# Altium schematic sheet STM32.SchDoc: STM32H563ZIT6
size B; SheetNumber: 3; SheetTotal: 14
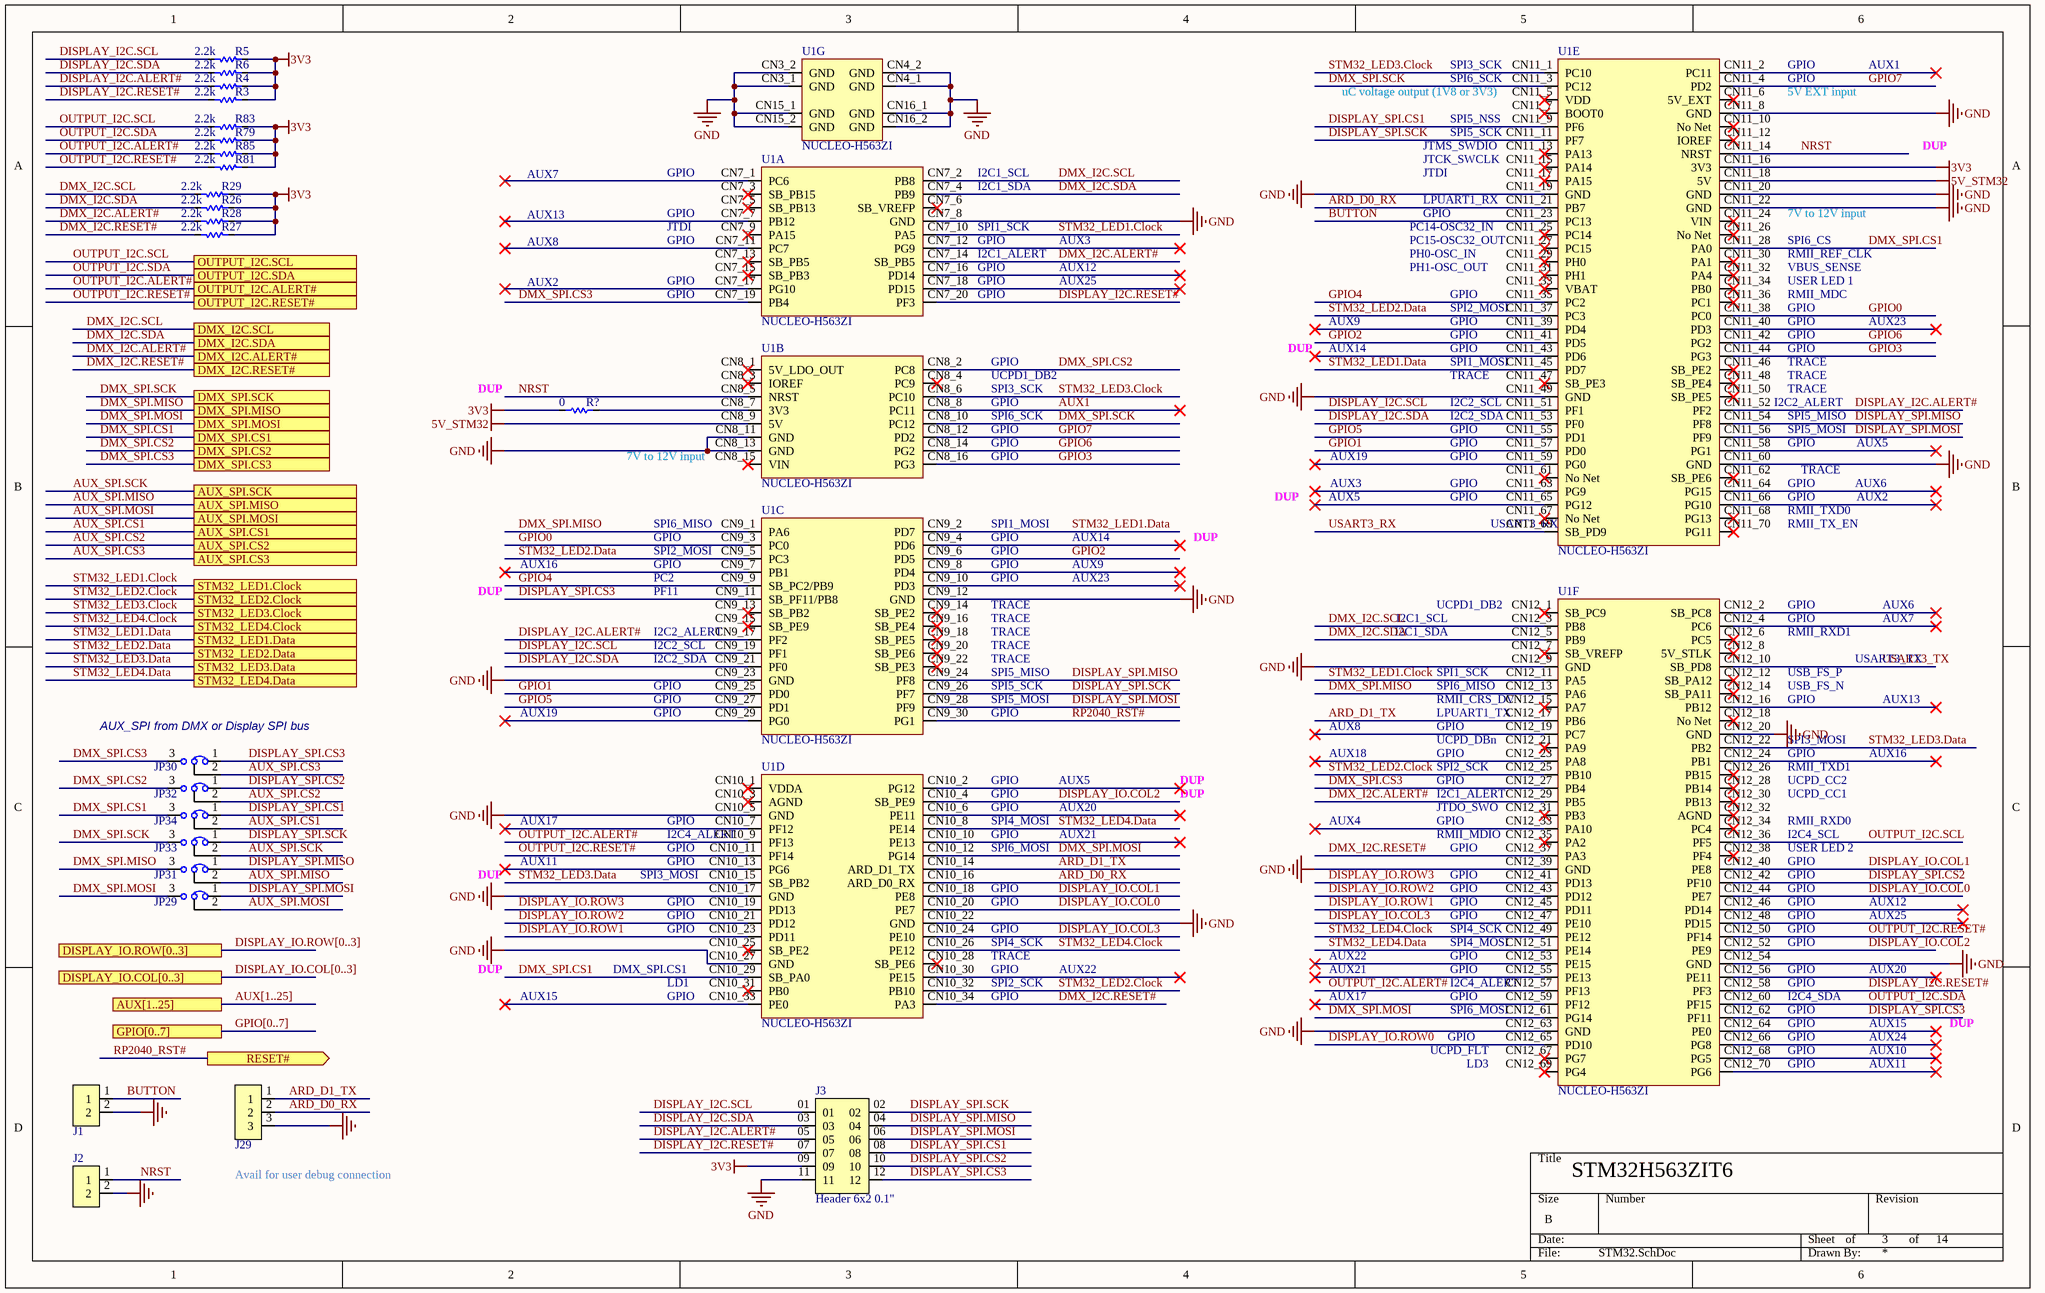
[diagram p0: STM32.SchDoc]

## Parts
J1  Header 2x1 0.1"  [FP-M20-9990245-MFG]  (value not drawn)
J2  Header 2x1 0.1"  [FP-M20-9990245-MFG]  (value not drawn)
J3  Header 6x2 0.1"  [HEADER 6x2 0.1 Through hole]
J29  Header 3x1 0.1"  [FP-PR20203VBNN-MFG]  (value not drawn)
JP29  Jumper 3 x 1 Bridge 1-2 Solder Bridge  [Jumper 3 Solder Bridge 1-2 0603]  (value not drawn)
JP30  Jumper 3 x 1 Bridge 1-2 Solder Bridge  [Jumper 3 Solder Bridge 1-2 0603]  (value not drawn)
JP31  Jumper 3 x 1 Bridge 1-2 Solder Bridge  [Jumper 3 Solder Bridge 1-2 0603]  (value not drawn)
JP32  Jumper 3 x 1 Bridge 1-2 Solder Bridge  [Jumper 3 Solder Bridge 1-2 0603]  (value not drawn)
JP33  Jumper 3 x 1 Bridge 1-2 Solder Bridge  [Jumper 3 Solder Bridge 1-2 0603]  (value not drawn)
JP34  Jumper 3 x 1 Bridge 1-2 Solder Bridge  [Jumper 3 Solder Bridge 1-2 0603]  (value not drawn)
R3  value 2.2k  [RESC1608X06N_0603_MED]  (hidden comment: RC0603FR-072K2L)
R4  value 2.2k  [RESC1608X06N_0603_MED]  (hidden comment: RC0603FR-072K2L)
R5  value 2.2k  [RESC1608X06N_0603_MED]  (hidden comment: RC0603FR-072K2L)
R6  value 2.2k  [RESC1608X06N_0603_MED]  (hidden comment: RC0603FR-072K2L)
R26  value 2.2k  [RESC1608X06N_0603_MED]  (hidden comment: RC0603FR-072K2L)
R27  value 2.2k  [RESC1608X06N_0603_MED]  (hidden comment: RC0603FR-072K2L)
R28  value 2.2k  [RESC1608X06N_0603_MED]  (hidden comment: RC0603FR-072K2L)
R29  value 2.2k  [RESC1608X06N_0603_MED]  (hidden comment: RC0603FR-072K2L)
R79  value 2.2k  [RESC1608X06N_0603_MED]  (hidden comment: RC0603FR-072K2L)
R81  value 2.2k  [RESC1608X06N_0603_MED]  (hidden comment: RC0603FR-072K2L)
R83  value 2.2k  [RESC1608X06N_0603_MED]  (hidden comment: RC0603FR-072K2L)
R85  value 2.2k  [RESC1608X06N_0603_MED]  (hidden comment: RC0603FR-072K2L)
R?  value 0  [RESC1608X06N_0603_MED]  (hidden comment: RC0603FR-070RL)
U1  NUCLEO-H563ZI  [NUCLEO-H563ZI-Below-Footprint]  (parts A,B,C,D,E,F,G of 7)

## Ports
AUX[1..25], AUX_SPI.CS1, AUX_SPI.CS2, AUX_SPI.CS3, AUX_SPI.MISO, AUX_SPI.MOSI, AUX_SPI.SCK, DISPLAY_IO.COL[0..3], DISPLAY_IO.ROW[0..3], DMX_I2C.ALERT#, DMX_I2C.RESET#, DMX_I2C.SCL, DMX_I2C.SDA, DMX_SPI.CS1, DMX_SPI.CS2, DMX_SPI.CS3, DMX_SPI.MISO, DMX_SPI.MOSI, DMX_SPI.SCK, GPIO[0..7], OUTPUT_I2C.ALERT#, OUTPUT_I2C.RESET#, OUTPUT_I2C.SCL, OUTPUT_I2C.SDA, RESET# (out), STM32_LED1.Clock, STM32_LED1.Data, STM32_LED2.Clock, STM32_LED2.Data, STM32_LED3.Clock, STM32_LED3.Data, STM32_LED4.Clock, STM32_LED4.Data

## Nets
3V3: J3.09 R3.2 R4.2 R5.2 R6.2 R26.2 R27.2 R28.2 R29.2 R79.2 R81.2 R83.2 R85.2 R?.1 U1.CN11_16(3V3)
5V_STM32: U1.CN8_9(5V) U1.CN11_18(5V)
GND: J1.2 J2.2 J3.11 J29.3 U1.CN3_1(GND) U1.CN3_2(GND) U1.CN4_1(GND) U1.CN4_2(GND) U1.CN7_8(GND) U1.CN8_11(GND) U1.CN8_13(GND) U1.CN9_12(GND) U1.CN9_23(GND) U1.CN10_5(GND) U1.CN10_17(GND) U1.CN10_22(GND) U1.CN10_27(GND) U1.CN11_8(GND) U1.CN11_19(GND) U1.CN11_20(GND) U1.CN11_22(GND) U1.CN11_49(GND) U1.CN11_60(GND) U1.CN12_9(GND) U1.CN12_20(GND) U1.CN12_39(GND) U1.CN12_54(GND) U1.CN12_63(GND) U1.CN15_1(GND) U1.CN15_2(GND) U1.CN16_1(GND) U1.CN16_2(GND)
ARD_D0_RX: J29.2 U1.CN10_16(ARD_D0_RX) U1.CN11_21(PB7)
ARD_D1_TX: J29.1 U1.CN10_14(ARD_D1_TX) U1.CN12_17(PB6)
AUX1: U1.CN8_8(PC11)
AUX_SPI.CS1: JP34.2 ; port AUX_SPI.CS1
AUX_SPI.CS2: JP32.2 ; port AUX_SPI.CS2
AUX_SPI.CS3: JP30.2 ; port AUX_SPI.CS3
AUX_SPI.MISO: JP31.2 ; port AUX_SPI.MISO
AUX_SPI.MOSI: JP29.2 ; port AUX_SPI.MOSI
AUX_SPI.SCK: JP33.2 ; port AUX_SPI.SCK
BUTTON: J1.1 U1.CN11_23(PC13)
DISPLAY_I2C.ALERT#: J3.05 R4.1 U1.CN9_17(PF2) U1.CN11_52(PF2)
DISPLAY_I2C.RESET#: J3.07 R3.1 U1.CN7_20(PF3) U1.CN12_58(PF3)
DISPLAY_I2C.SCL: J3.01 R5.1 U1.CN9_19(PF1) U1.CN11_51(PF1)
DISPLAY_I2C.SDA: J3.03 R6.1 U1.CN9_21(PF0) U1.CN11_53(PF0)
DISPLAY_IO.COL0: U1.CN10_20(PE7) U1.CN12_44(PE7)
DISPLAY_IO.COL1: U1.CN10_18(PE8) U1.CN12_40(PE8)
DISPLAY_IO.COL2: U1.CN10_4(SB_PE9) U1.CN12_52(PE9)
DISPLAY_IO.COL3: U1.CN10_24(PE10) U1.CN12_47(PE10)
DISPLAY_IO.ROW0: U1.CN12_65(PD10)
DISPLAY_IO.ROW1: U1.CN10_23(PD11) U1.CN12_45(PD11)
DISPLAY_IO.ROW2: U1.CN10_21(PD12) U1.CN12_43(PD12)
DISPLAY_IO.ROW3: U1.CN10_19(PD13) U1.CN12_41(PD13)
DISPLAY_SPI.CS1: J3.08 JP34.1 U1.CN11_9(PF6)
DISPLAY_SPI.CS2: J3.10 JP32.1 U1.CN12_42(PF10)
DISPLAY_SPI.CS3: J3.12 JP30.1 U1.CN9_11(SB_PF11/PB8) U1.CN12_62(PF11)
DISPLAY_SPI.MISO: J3.04 JP31.1 U1.CN9_24(PF8) U1.CN11_54(PF8)
DISPLAY_SPI.MOSI: J3.06 JP29.1 U1.CN9_28(PF9) U1.CN11_56(PF9)
DISPLAY_SPI.SCK: J3.02 JP33.1 U1.CN9_26(PF7) U1.CN11_11(PF7)
DMX_I2C.ALERT#: R28.1 U1.CN7_14(SB_PB5) U1.CN12_29(PB5) ; port DMX_I2C.ALERT#
DMX_I2C.RESET#: R27.1 U1.CN10_34(PA3) U1.CN12_37(PA3) ; port DMX_I2C.RESET#
DMX_I2C.SCL: R29.1 U1.CN7_2(PB8) U1.CN12_3(PB8) ; port DMX_I2C.SCL
DMX_I2C.SDA: R26.1 U1.CN7_4(PB9) U1.CN12_5(PB9) ; port DMX_I2C.SDA
DMX_SPI.CS1: JP34.3 U1.CN10_29(SB_PA0) U1.CN11_28(PA0) ; port DMX_SPI.CS1
DMX_SPI.CS2: JP32.3 U1.CN8_2(PC8) ; port DMX_SPI.CS2
DMX_SPI.CS3: JP30.3 U1.CN7_19(PB4) U1.CN12_27(PB4) ; port DMX_SPI.CS3
DMX_SPI.MISO: JP31.3 U1.CN9_1(PA6) U1.CN12_13(PA6) ; port DMX_SPI.MISO
DMX_SPI.MOSI: JP29.3 U1.CN10_12(PG14) U1.CN12_61(PG14) ; port DMX_SPI.MOSI
DMX_SPI.SCK: JP33.3 U1.CN8_10(PC12) U1.CN11_3(PC12) ; port DMX_SPI.SCK
GPIO0: U1.CN9_3(PC0) U1.CN11_38(PC0)
GPIO1: U1.CN9_25(PD0) U1.CN11_57(PD0)
GPIO2: U1.CN9_6(PD5) U1.CN11_41(PD5)
GPIO3: U1.CN8_16(PG3) U1.CN11_44(PG3)
GPIO4: U1.CN9_9(SB_PC2/PB9) U1.CN11_35(PC2)
GPIO5: U1.CN9_27(PD1) U1.CN11_55(PD1)
GPIO6: U1.CN8_14(PG2) U1.CN11_42(PG2)
GPIO7: U1.CN8_12(PD2) U1.CN11_4(PD2)
NRST: J2.1 U1.CN8_5(NRST) U1.CN11_14(NRST)
OUTPUT_I2C.ALERT#: R85.1 U1.CN10_9(PF13) U1.CN12_57(PF13) ; port OUTPUT_I2C.ALERT#
OUTPUT_I2C.RESET#: R81.1 U1.CN10_11(PF14) U1.CN12_50(PF14) ; port OUTPUT_I2C.RESET#
OUTPUT_I2C.SCL: R83.1 U1.CN12_36(PF5) ; port OUTPUT_I2C.SCL
OUTPUT_I2C.SDA: R79.1 U1.CN12_60(PF15) ; port OUTPUT_I2C.SDA
RP2040_RST#: U1.CN9_30(PG1) ; port RESET#
STM32_LED1.Clock: U1.CN7_10(PA5) U1.CN12_11(PA5) ; port STM32_LED1.Clock
STM32_LED1.Data: U1.CN9_2(PD7) U1.CN11_45(PD7) ; port STM32_LED1.Data
STM32_LED2.Clock: U1.CN10_32(PB10) U1.CN12_25(PB10) ; port STM32_LED2.Clock
STM32_LED2.Data: U1.CN9_5(PC3) U1.CN11_37(PC3) ; port STM32_LED2.Data
STM32_LED3.Clock: U1.CN8_6(PC10) U1.CN11_1(PC10) ; port STM32_LED3.Clock
STM32_LED3.Data: U1.CN10_15(SB_PB2) U1.CN12_22(PB2) ; port STM32_LED3.Data
STM32_LED4.Clock: U1.CN10_26(PE12) U1.CN12_49(PE12) ; port STM32_LED4.Clock
STM32_LED4.Data: U1.CN10_8(PE14) U1.CN12_51(PE14) ; port STM32_LED4.Data
USART3_RX: U1.CN11_69(SB_PD9)
USART3_TX: U1.CN12_10(SB_PD8)
NetR?_2: R?.2 U1.CN8_7(3V3)

Not connected (* = marked no-connect by the designer): U1 CN7_1(PC6)* CN7_3(SB_PB15)* CN7_5(SB_PB13)* CN7_6(SB_VREFP)* CN7_7(PB12)* CN7_9(PA15)* CN7_11(PC7)* CN7_12(PG9)* CN7_13(SB_PB5)* CN7_15(SB_PB3)* CN7_16(PD14)* CN7_17(PG10)* CN7_18(PD15)* CN8_1(5V_LDO_OUT)* CN8_3(IOREF)* CN8_4(PC9)* CN8_15(VIN)* CN9_4(PD6)* CN9_7(PB1)* CN9_8(PD4)* CN9_10(PD3)* CN9_13(SB_PB2)* CN9_14(SB_PE2)* CN9_15(SB_PE9)* CN9_16(SB_PE4)* CN9_18(SB_PE5)* CN9_20(SB_PE6)* CN9_22(SB_PE3)* CN9_29(PG0)* CN10_1(VDDA)* CN10_2(PG12)* CN10_3(AGND)* CN10_6(PE11)* CN10_7(PF12)* CN10_10(PE13)* CN10_13(PG6)* CN10_25(SB_PE2)* CN10_28(SB_PE6)* CN10_30(PE15)* CN10_31(PB0)* CN10_33(PE0)* CN11_2(PC11)* CN11_5(VDD)* CN11_6(5V_EXT)* CN11_7(BOOT0)* CN11_10(No_Net)* CN11_12(IOREF)* CN11_13(PA13)* CN11_15(PA14)* CN11_17(PA15)* CN11_24(VIN)* CN11_25(PC14)* CN11_26(No_Net)* CN11_27(PC15)* CN11_29(PH0)* CN11_30(PA1)* CN11_31(PH1)* CN11_32(PA4)* CN11_33(VBAT)* CN11_34(PB0)* CN11_36(PC1)* CN11_39(PD4)* CN11_40(PD3)* CN11_43(PD6)* CN11_46(SB_PE2)* CN11_47(SB_PE3)* CN11_48(SB_PE4)* CN11_50(SB_PE5)* CN11_58(PG1)* CN11_59(PG0)* CN11_61(No_Net)* CN11_62(SB_PE6)* CN11_63(PG9)* CN11_64(PG15)* CN11_65(PG12)* CN11_66(PG10)* CN11_67(No_Net)* CN11_68(PG13)* CN11_70(PG11)* CN12_1(SB_PC9)* CN12_2(SB_PC8)* CN12_4(PC6)* CN12_6(PC5)* CN12_7(SB_VREFP)* CN12_8(5V_STLK)* CN12_12(SB_PA12)* CN12_14(SB_PA11)* CN12_15(PA7)* CN12_16(PB12)* CN12_18(No_Net)* CN12_19(PC7)* CN12_21(PA9)* CN12_23(PA8)* CN12_24(PB1)* CN12_26(PB15)* CN12_28(PB14)* CN12_30(PB13)* CN12_31(PB3)* CN12_32(AGND)* CN12_33(PA10)* CN12_34(PC4)* CN12_35(PA2)* CN12_38(PF4)* CN12_46(PD14)* CN12_48(PD15)* CN12_53(PE15)* CN12_55(PE13)* CN12_56(PE11)* CN12_59(PF12)* CN12_64(PE0)* CN12_66(PG8)* CN12_67(PG7)* CN12_68(PG5)* CN12_69(PG4)* CN12_70(PG6)*

## Buses and harness runs
bus AUX[1..25] = port AUX[1..25]
bus DISPLAY_IO.COL[0..3] = port DISPLAY_IO.COL[0..3]
bus DISPLAY_IO.ROW[0..3] = port DISPLAY_IO.ROW[0..3]
bus GPIO[0..7] = port GPIO[0..7]

## Notes on the sheet
- (near U1) uC voltage output (1V8 or 3V3)
- SPI3_SCK
- SPI6_SCK
- 5V EXT input
- GPIO
- AUX1
- JTMS_SWDIO
- JTCK_SWCLK
- SPI5_NSS
- SPI5_SCK
- DUP
- AUX7
- AUX13
- AUX8
- JTDI
- I2C1_SCL
- I2C1_SDA
- SPI1_SCK
- PC14-OSC32_IN
- LPUART1_RX
- 7V to 12V input
- AUX2
- I2C1_ALERT
- AUX3
- AUX12
- AUX25
- PC15-OSC32_OUT
- PH0-OSC_IN
- PH1-OSC_OUT
- SPI6_CS
- RMII_REF_CLK
- VBUS_SENSE
- RMII_MDC
- USER LED 1
- AUX9
- AUX14
- (near U1) SPI2_MOSI
- (near U1) SPI1_MOSI
- TRACE
- AUX23
- UCPD1_DB2
- I2C2_SCL
- I2C2_SDA
- I2C2_ALERT
- SPI5_MISO
- SPI5_MOSI
- AUX5
- AUX19
- AUX6
- AUX16
- (near U1) SPI6_MISO
- SPI1_MOSI
- USART3_RX
- RMII_TXD0
- RMII_TX_EN
- (near U1) I2C2_ALERT
- PC2
- PF11
- RMII_RXD1
- RMII_CRS_DV
- SPI6_MISO
- USB_FS_P
- USB_FS_N
- USART3_TX
- (near JP30) AUX_SPI from DMX or Display SPI bus
- AUX18
- LPUART1_TX
- UCPD_DBn
- SPI2_SCK
- SPI3_MOSI
- RMII_TXD1
- AUX17
- (near U1) I2C4_ALERT
- SPI4_MOSI
- AUX20
- AUX21
- AUX4
- RMII_MDIO
- JTDO_SWO
- I2C4_SCL
- UCPD_CC1
- UCPD_CC2
- RMII_RXD0
- AUX11
- SPI6_MOSI
- USER LED 2
- DMX_SPI.CS1
- SPI4_SCK
- AUX22
- (near U1) SPI4_MOSI
- AUX15
- LD1
- (near U1) SPI6_MOSI
- I2C4_SDA
- AUX24
- UCPD_FLT
- LD3
- AUX10
- (near J29) Avail for user debug connection
- of

## Library data of the parts
J1 J2 = CMP-002-00082-2: Conn Header Vert 2POS 2.54MM; Connector Type: BOARD CONNECTOR; RoHS Compliant: Yes; Min Operating Temperature: -40°C; Mounting Technology: Through Hole; Pins: 2; Max Operating Temperature: 105°C
J3 = CMP-002-00221-2: Board Connector Tall, 12 Contact(s), 2 Row(s), Male, Straight, 0.1 inch Pitch; Max Current Rating: 3A; Connector Type: Header; Gender: Male; Pins: 12; Mounting Technology: Board; RoHS Compliant: Yes
J29 = CMP-002-00081-5: Conn Header Vert 3POS 2.54MM; Pins: 3
JP29-JP34 = CMP-009-00341-2: 0603 Solder Bridge Jumper Surface Mount; Voltage Rating: 75V; Tolerance: 1%; Value: 0; Max Operating Temperature: 155°C; Pins: 2; Case/Package: 0603; Min Operating Temperature: -55°C; RoHS Compliant: Yes; Mounting Technology: Surface Mount
R3-R6 R26-R29 R79 R81 R83 R85 = CMP-009-00304-2: Fixed Resistor, Metal Glaze/thick Film, 0.1W, 2200ohm, 75V, 1% +/-Tol, 100ppm/Cel, Surface Mount, 0603; Power: 100mW; Voltage Rating: 50V; Min Operating Temperature: -55°C; Max Operating Temperature: 155°C; Tolerance: 1%; Case/Package: 0603; Pins: 2; Mounting Technology: Surface Mount; RoHS Compliant: Yes; JLCPN: C114662
R? = CMP-009-00204-3: RC Series 0603 0.1 W 0 Ohm Jumper Surface Mount Thick Film Chip Resistor; Tolerance: 1%; Voltage Rating: 75V; Power: 100mW; Min Operating Temperature: -55°C; Pins: 2; Case/Package: 0603; Max Operating Temperature: 155°C; RoHS Compliant: Yes; Mounting Technology: Surface Mount; JLCPN: C100044
U1 = CMP-020-00024-9: Dev Nucleo Board, 32Bit, Arm, Cortex-M Rohs Compliant: Yes